# EAGLE design 4 board (EAGLE 9.2.2)
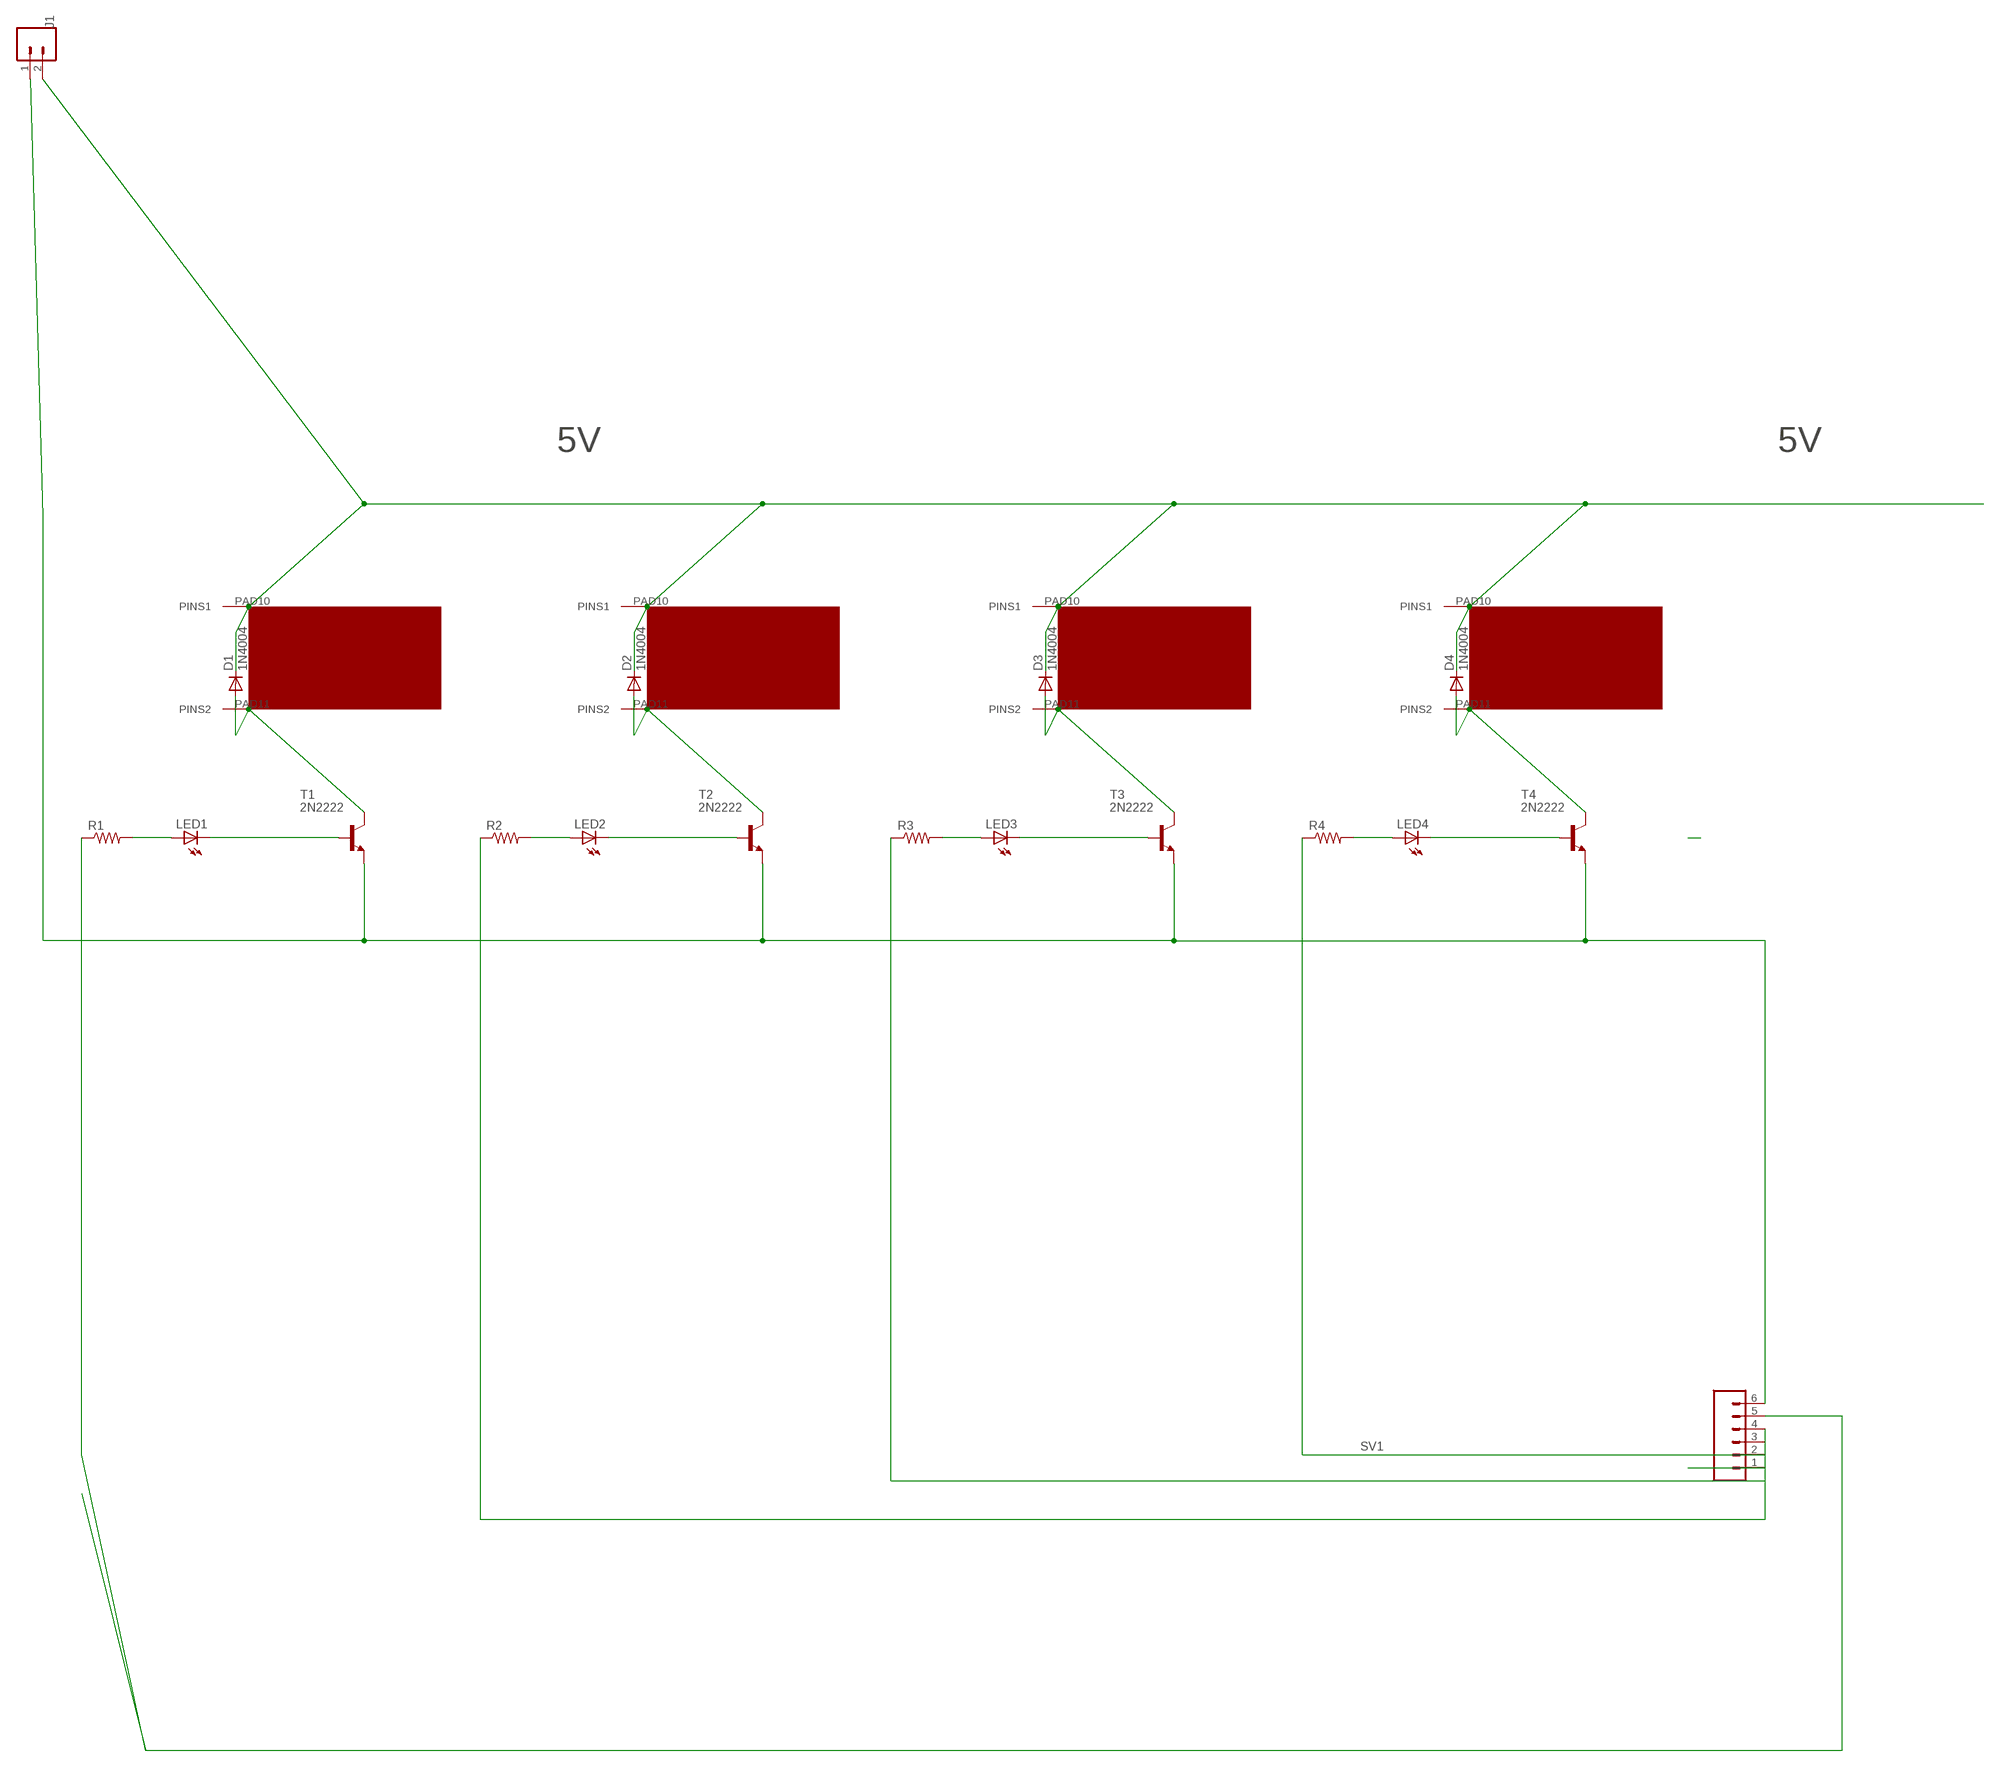
[diagram p0: schematic, sheet 1]

## Parts
D1  1N4004  [DO41-10]
D2  1N4004  [DO41-10]
D3  1N4004  [DO41-10]
D4  1N4004  [DO41-10]
J1  CONN_023.5MM  [SCREWTERMINAL-3.5MM-2]
LED1  LED5MM  [LED5MM]
LED2  LED5MM  [LED5MM]
LED3  LED5MM  [LED5MM]
LED4  LED5MM  [LED5MM]
R1  R-US_0207/10  [0207/10]
R2  R-US_0207/10  [0207/10]
R3  R-US_0207/10  [0207/10]
R4  R-US_0207/10  [0207/10]
SV1  CONN_06LOCK  [1X06_LOCK]
T1  2N2222  [TO92-EBC-OVAL]
T2  2N2222  [TO92-EBC-OVAL]
T3  2N2222  [TO92-EBC-OVAL]
T4  2N2222  [TO92-EBC-OVAL]
U$1  VALVE  [VALVTEST2]
U$2  VALVE  [VALVTEST2]
VALVE3  VALVE  [VALVTEST2]
VALVE4  4  VALVE  [VALVTEST2]

## Nets
5V: D1.C D2.C D3.C D4.C J1.2 U$1.PAD10(PINS1) U$2.PAD10(PINS1) VALVE3.PAD10(PINS1) VALVE4.PAD10(PINS1)
GND: J1.1 SV1.6 T1.E T2.E T3.E T4.E
N$1: D1.A T1.C U$1.PAD11(PINS2)
N$2: LED1.K(C) T1.B
N$3: LED1.A R1.2
N$4: D4.A T4.C VALVE4.PAD11(PINS2)
N$5: D2.A T2.C U$2.PAD11(PINS2)
N$6: LED2.K(C) T2.B
N$7: LED2.A R2.2
N$8: LED4.K(C) T4.B
N$9: D3.A T3.C VALVE3.PAD11(PINS2)
N$10: LED3.K(C) T3.B
N$11: LED3.A R3.2
N$12: LED4.A R4.2
N$19: R3.1 SV1.3
N$30: R1.1 SV1.5
N$43: R4.1 SV1.2
N$44: R2.1 SV1.4
N$45: SV1.1

## Library data of the parts
D1-D4 = adafruit:1N4004: DIODE General purpose 1N400x type rectifier (With bigger pads) http://www.ladyada.net/library/pcb/eaglelibrary.html
J1 = SparkFun-Connectors:CONN_02: Multi connection point. Often used as Generic Header-pin footprint for 0.1 inch spaced/style header connections On any of the 0.1 inch spaced packages, you can populate with these: Break Away Headers - Straight <https://www.sparkfun.com/products/116> (PRT-00116) Break Away Male Headers - Right Angle <https://www.sparkfun.com/products/553> (PRT-00553) Female Headers <https://www.sparkfun.com/products/115> (PRT-00115) Break Away Headers - Machine Pin <https://www.sparkfun.com/products/117> (PRT-00117) Break Away Female Headers - Swiss Machine Pin <https://www.sparkfun.com/products/743> (PRT-00743) For SCREWTERMINALS and SPRING TERMINALS visit here: Screw Terimnals on SparkFun.com <https://www.sparkfun.com/search/results?term=Screw+Terminals> (5mm/3.5mm/2.54mm spacing) This device is also useful as a general connection point to wire up your design to another part of your project. Our various solder wires solder well into these plated through hole pads. Hook-Up Wire - Assortment (Stranded, 22 AWG) <https://www.sparkfun.com/products/11375> (PRT-11375) Hook-Up Wire - Assortment (Solid Core, 22 AWG) <https://www.sparkfun.com/products/11367> (PRT-11367) View the entire wire category on our website here <https://www.sparkfun.com/categories/141> Special notes: Molex polarized connector foot print use with: PRT-08233 with associated crimp pins and housings. 2.54_SCREWTERM for use with PRT-10571. 3.5mm Screw Terminal footprints for PRT-08084 5mm Screw Terminal footprints for use with PRT-08432; PROD_ID: CONN-08399
LED1-LED4 = adafruit:LED: LED OSRAM: - CHIPLED LG R971, LG N971, LY N971, LG Q971, LY Q971, LO R971, LY R971 LH N974, LH R974 LS Q976, LO Q976, LY Q976 LO Q996 - Hyper CHIPLED LW Q18S LB Q993, LB Q99A, LB R99A - SideLED LS A670, LO A670, LY A670, LG A670, LP A670 LB A673, LV A673, LT A673, LW A673 LH A674 LY A675 LS A676, LA A676, LO A676, LY A676, LW A676 LS A679, LY A679, LG A679 - Hyper Micro SIDELED® LS Y876, LA Y876, LO Y876, LY Y876 LT Y87S - SmartLED LW L88C, LW L88S LB L89C, LB L89S, LG L890 LS L89K, LO L89K, LY L89K LS L896, LA L896, LO L896, LY L896 - TOPLED LS T670, LO T670, LY T670, LG T670, LP T670 LSG T670, LSP T670, LSY T670, LOP T670, LYG T670 LG T671, LOG T671, LSG T671 LB T673, LV T673, LT T673, LW T673 LH T674 LS T676, LA T676, LO T676, LY T676, LB T676, LH T676, LSB T676, LW T676 LB T67C, LV T67C, LT T67C, LS T67K, LO T67K, LY T67K, LW E67C LS E67B, LA E67B, LO E67B, LY E67B, LB E67C, LV E67C, LT E67C LW T67C LS T679, LY T679, LG T679 LS T770, LO T770, LY T770, LG T770, LP T770 LB T773, LV T773, LT T773, LW T773 LH T774 LS E675, LA E675, LY E675, LS T675 LS T776, LA T776, LO T776, LY T776, LB T776 LHGB T686 LT T68C, LB T68C - Hyper Mini TOPLED® LB M676 - Mini TOPLED Santana® LG M470 LS M47K, LO M47K, LY M47K Source: http://www.osram.convergy.de/
R1-R4 = adafruit:R-US_: RESISTOR, American symbol
SV1 = SparkFun-Connectors:CONN_06: Multi connection point. Often used as Generic Header-pin footprint for 0.1 inch spaced/style header connections On any of the 0.1 inch spaced packages, you can populate with these: Break Away Headers - Straight <https://www.sparkfun.com/products/116> (PRT-00116) Break Away Male Headers - Right Angle <https://www.sparkfun.com/products/553> (PRT-00553) Female Headers <https://www.sparkfun.com/products/115> (PRT-00115) Break Away Headers - Machine Pin <https://www.sparkfun.com/products/117> (PRT-00117) Break Away Female Headers - Swiss Machine Pin <https://www.sparkfun.com/products/743> (PRT-00743) Arduino Stackable Header - 6 Pin <https://www.sparkfun.com/products/9280> (PRT-09280) For SCREWTERMINALS and SPRING TERMINALS visit here: Screw Terimnals on SparkFun.com <https://www.sparkfun.com/search/results?term=Screw+Terminals> (5mm/3.5mm/2.54mm spacing) This device is also useful as a general connection point to wire up your design to another part of your project. Our various solder wires solder well into these plated through hole pads. Hook-Up Wire - Assortment (Stranded, 22 AWG) <https://www.sparkfun.com/products/11375> (PRT-11375) Hook-Up Wire - Assortment (Solid Core, 22 AWG) <https://www.sparkfun.com/products/11367> (PRT-11367) View the entire wire category on our website here <https://www.sparkfun.com/categories/141>
T1-T4 = adafruit:2N2222: NPN TRANSISTOR Big oval pads
U$1 U$2 VALVE3 VALVE4 = local eagle library:VALVE: pn eumatic valve

## Board
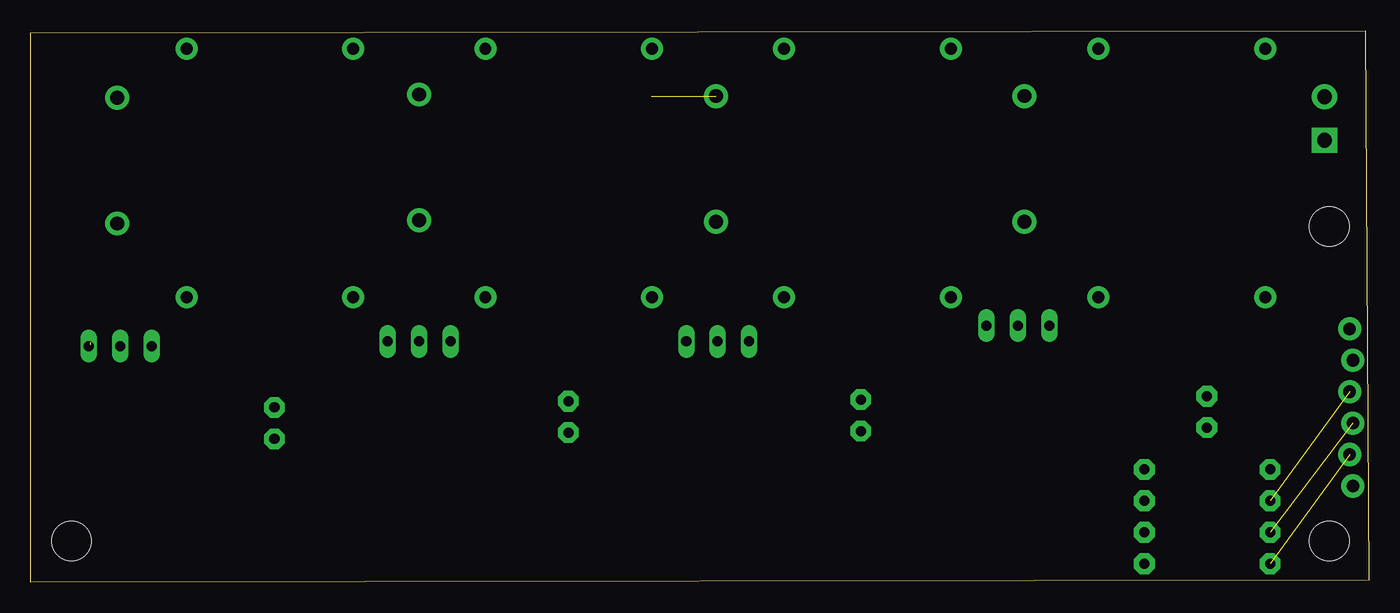
[diagram p1: board, top side]
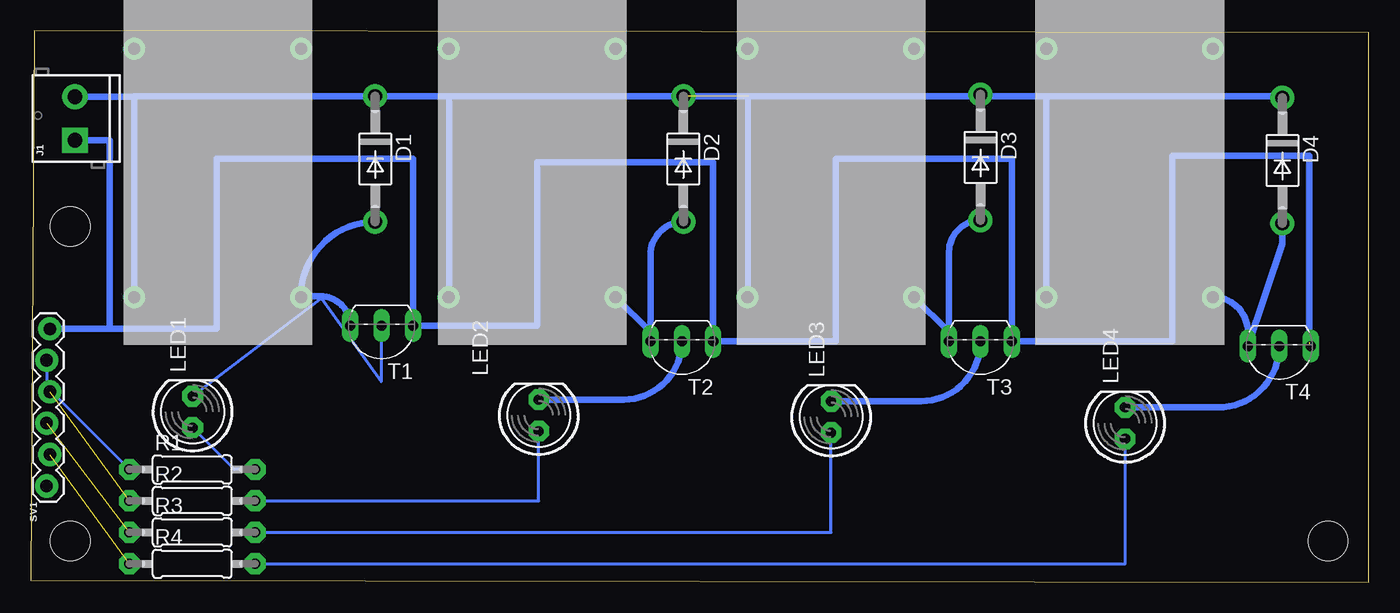
[diagram p2: board, bottom side, seen from below]

Size 108.06 x 44.5 mm. Coordinates in mm from the lower left corner, seen from the top.
Outline: 108.06,0.13 0,0 0,44.37 107.8,44.5 108.06,0.13
Copper layers (1*16): Top 0.035mm / dielectric 1.5mm / Bottom 0.035mm
Design rules "default": minimum track width 6mil, minimum drill 0.35mm, track to track 6mil, track to pad 6mil, pad to pad 6mil, via to via 6mil, smd to smd 6mil, copper to edge 40mil, drill to drill 6mil, minimum pad ring 10mil, minimum via ring 8mil, stop-mask expansion 4mil, vias tented up to drill 0mil, thermal gap 10mil
Holes 3.17 mm at 104.88,3.3 104.88,28.7 3.28,3.3

### Footprints (pad centres in the part's own frame; a part is rotated, then mirrored left to right if it is on the bottom)
DO41-10 = drill 1.118 pad 1.93: A 5.08,0; C -5.08,0
SCREWTERMINAL-3.5MM-2 = drill 1.2 pad 2.032 square: 1 0,0 | drill 1.2 pad 2.032: 2 3.5,0
LED5MM = drill 0.813 pad 1.676 octagon: A -1.27,0; K 1.27,0
0207/10 = drill 0.813 pad 1.676 octagon: 1 -5.08,0; 2 5.08,0
1X06_LOCK = drill 1.016 pad 1.88: 1 0,0; 2 2.54,-0.254; 3 5.08,0; 4 7.62,-0.254; 5 10.16,0; 6 12.7,-0.254
TO92-EBC-OVAL = drill 0.813 long: B 0,-1.27; C 2.54,-1.27; E -2.54,-1.27
VALVTEST2 = drill 0.965 pad 1.778: PAD10 3.835,-0.864; PAD11 3.835,-14.326; PAD12 23.901,-14.326; PAD13 23.901,-0.864

### Placement (x,y rotation side)
D1  80.24,34.16 270 bottom
D2  55.35,34.16 270 bottom
D3  31.35,34.29 270 bottom
D4  6.96,34.04 270 bottom
J1  104.5,35.69 90 bottom
LED1  95,13.74 90 bottom
LED2  67.04,13.46 90 bottom
LED3  43.41,13.33 90 bottom
LED4  19.67,12.83 90 bottom
R1  95.03,9.09 0 bottom
R2  95.03,6.55 0 bottom
R3  95.03,4.01 0 bottom
R4  95.03,1.47 0 bottom
SV1  106.79,7.75 90 bottom
T1  79.74,19.43 180 bottom
T2  55.48,18.16 180 bottom
T3  31.35,18.16 180 bottom
T4  7.22,17.78 180 bottom
U$1  100.56,19.18 90 bottom
U$2  75.16,19.18 90 bottom
VALVE3  51.03,19.18 90 bottom
VALVE4  26.9,19.18 90 bottom

### Tracks (layer width: path | path; a pad name or v marks a point on that pad's centre or on a via)
5V  (1 unrouted)
  Bottom 0.508: 99.7,39.19 J1.2 | 74.28,39.24 D1.C 99.7,39.24 99.7,39.19 | 50.15,39.24 31.48,39.24 D3.C 31.1,39.37 31.1,39.24 26.04,39.24 | 50.15,39.24 74.28,39.24 | 26.04,39.24 6.97,39.24 D4.C | U$1.PAD10 99.7,39.19 | 74.28,39.24 74.28,23.01 U$2.PAD10 | VALVE3.PAD10 50.15,23.01 50.15,39.24 | 26.04,39.24 VALVE4.PAD10
GND  (1 unrouted)
  Bottom 0.508: J1.1 101.71,35.69 101.71,20.45 | 101.71,20.45 93.07,20.45 93.07,34.16 77.2,34.16 T1.E 67.16,20.7 67.16,33.91 52.94,33.91 T2.E 43.03,19.43 43.03,34.16 28.81,34.16 T3.E 15.86,19.43 15.86,34.42 4.81,34.42 4.81,19.37 | T4.E 4.81,19.18 | SV1.6 101.71,20.45
N$1
  Bottom 0.508: D1.A arc-90 86.24,23.09 | 86.24,23.09 U$1.PAD11 | T1.C arc-90 84.66,23.09 86.24,23.09
N$2
  Bottom 0.254: LED1.K 84.58,22.9 79.74,16.19 T1.B
N$3
  Bottom 0.254: LED1.A 91.62,9.09 R1.2
N$4
  Bottom 0.508: D4.A 6.97,27.3 T4.C 9.76,20.19 arc-90 VALVE4.PAD11
N$5
  Bottom 0.508: D2.A arc-90 58.02,26.42 T2.C arc-90 58.02,20.19 U$2.PAD11
N$6
  Bottom 0.508: T2.B arc90 60.18,14.73 LED2.K
N$7
  Bottom 0.254: R2.2 67.04,6.55 LED2.A
N$8
  Bottom 0.508: T4.B arc90 12.17,14.1 LED4.K
N$9
  Bottom 0.508: D3.A arc-90 33.89,26.67 T3.C arc-90 33.89,20.19 VALVE3.PAD11
N$10
  Bottom 0.508: T3.B arc90 36.18,14.61 LED3.K
N$11
  Bottom 0.254: R3.2 43.41,4.01 LED3.A
N$12
  Bottom 0.254: R4.2 19.67,1.47 LED4.A
N$19  (1 unrouted)
N$30
  Bottom 0.254: SV1.5 106.79,15.77 R1.1
N$43  (1 unrouted)
N$44  (1 unrouted)